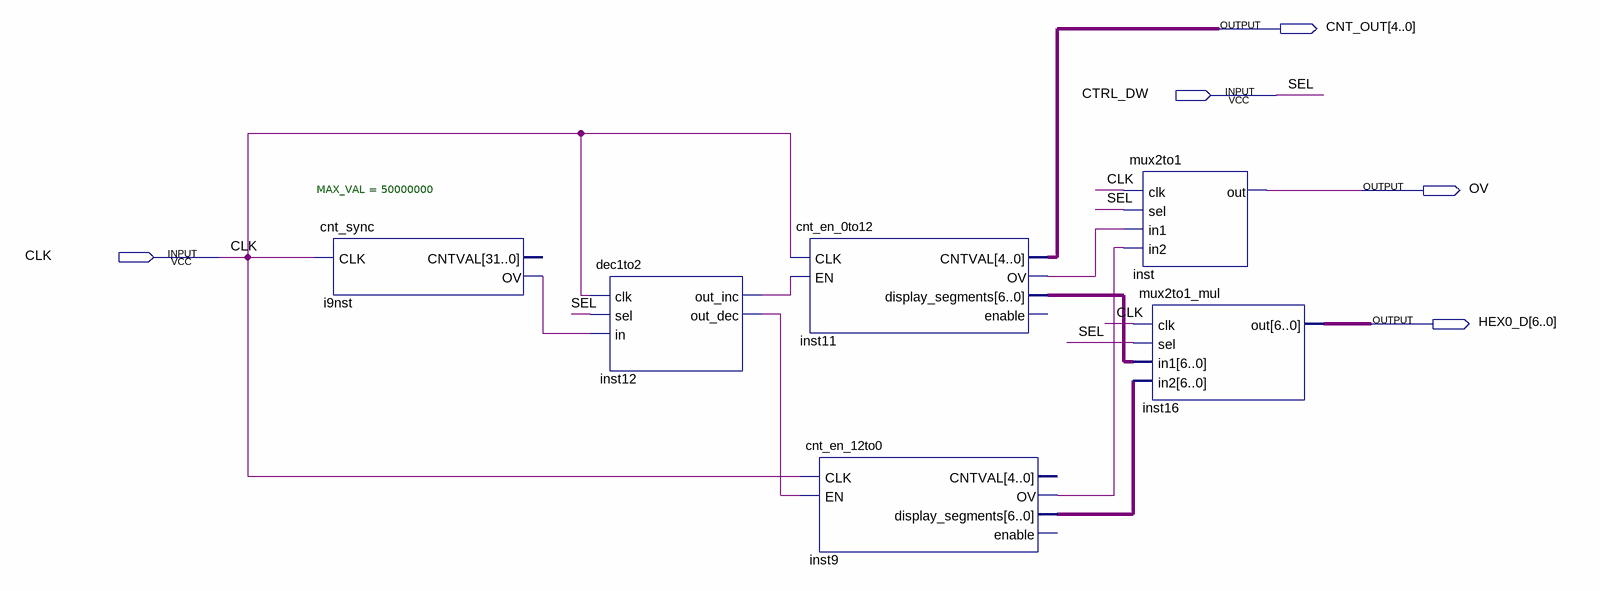
[diagram p0: schematic sheet]
// Quartus schematic clock.bdf as structural Verilog: 6 symbols, 5 pins
module clock (
  input  CTRL_DW,
  input  CLK,
  output [4:0] CNT_OUT,
  output OV,
  output [6:0] HEX0_D
);

  wire i9nst_ov, inst9_ov, inst11_ov, inst12_out_dec, inst12_out_inc;
  wire [6:0] inst9_display_segments, inst11_display_segments;

  cnt_sync #(.MAX_VAL(50000000)) i9nst (.CLK(CLK), .OV(i9nst_ov));  // open: CNTVAL
  dec1to2 inst12 (.clk(CLK), .sel(CTRL_DW), .in(i9nst_ov), .out_inc(inst12_out_inc), .out_dec(inst12_out_dec));
  cnt_en_0to12 inst11 (
    .CLK(CLK), .EN(inst12_out_inc), .CNTVAL(CNT_OUT), .OV(inst11_ov),
    .display_segments(inst11_display_segments));  // open: enable
  cnt_en_12to0 inst9 (
    .CLK(CLK), .EN(inst12_out_dec), .OV(inst9_ov), .display_segments(inst9_display_segments));  // open: CNTVAL, enable
  mux2to1 inst (.clk(CLK), .sel(CTRL_DW), .in1(inst11_ov), .in2(inst9_ov), .out(OV));
  mux2to1_mul inst16 (
    .clk(CLK), .sel(CTRL_DW), .in1(inst11_display_segments), .in2(inst9_display_segments), .out(HEX0_D));

  // Other names for the same wires on the sheet: SEL = CTRL_DW
endmodule
